# Altium schematic sheet CDRon_mainSheet.SchDoc
size A4
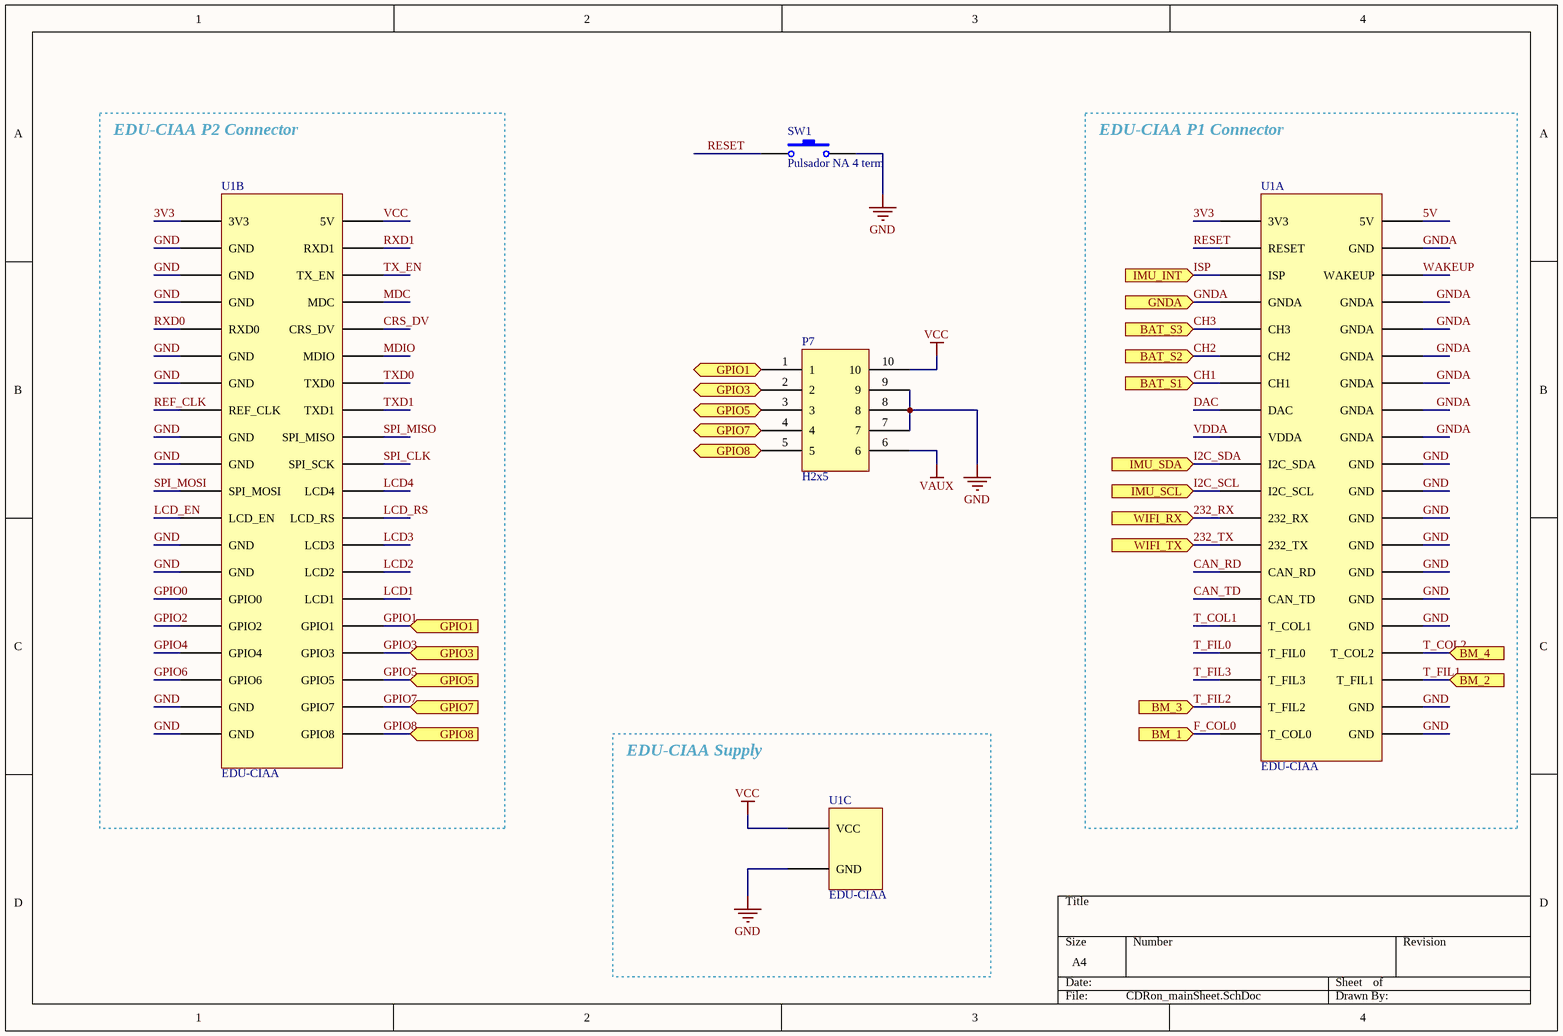
[diagram p0: CDRon_mainSheet.SchDoc]

## Parts
P7  H2x5  [H2x5]
SW1  Pulsador NA 4 term  [TACT SW]
U1  EDU-CIAA  [EDU-CIAA]  (parts A,B,C of 3)

## Blocks framed on the sheet
EDU-CIAA P2 Connector: U1
EDU-CIAA P1 Connector: U1
EDU-CIAA Supply: U1

## Ports
BAT_S1 (in), BAT_S2 (in), BAT_S3 (in), BM_1 (in), BM_2 (in), BM_3 (in), BM_4 (in), GNDA (in), GPIO1 (in), GPIO3 (in), GPIO5 (in), GPIO7 (in), GPIO8 (in), IMU_INT (in), IMU_SCL (in), IMU_SDA (in), WIFI_RX (in), WIFI_TX (in)

## Nets
GND: P7.7 P7.8 P7.9 SW1.2 U1.20(GND) U1.22(GND) U1.24(GND) U1.26(GND) U1.28(GND) U1.30(GND) U1.32(GND) U1.38(GND) U1.40(GND) U1.43(GND) U1.45(GND) U1.47(GND) U1.51(GND) U1.53(GND) U1.57(GND) U1.59(GND) U1.65(GND) U1.67(GND) U1.77(GND) U1.79(GND) U1.82(GND)
VAUX: P7.6
VCC: P7.10 U1.42(5V) U1.81(VCC)
3V3: U1.1(3V3) U1.41(3V3)
5V: U1.2(5V)
232_RX: U1.23(232_RX) ; port WIFI_RX
232_TX: U1.25(232_TX) ; port WIFI_TX
CAN_RD: U1.27(CAN_RD)
CAN_TD: U1.29(CAN_TD)
CH1: U1.13(CH1) ; port BAT_S1
CH2: U1.11(CH2) ; port BAT_S2
CH3: U1.9(CH3) ; port BAT_S3
CRS_DV: U1.50(CRS_DV)
DAC: U1.15(DAC)
F_COL0: U1.39(T_COL0) ; port BM_1
GNDA: U1.4(GND) U1.7(GNDA) U1.8(GNDA) U1.10(GNDA) U1.12(GNDA) U1.14(GNDA) U1.16(GNDA) U1.18(GNDA) ; port GNDA
GPIO0: U1.69(GPIO0)
GPIO1: P7.1 U1.72(GPIO1) ; port GPIO1
GPIO2: U1.71(GPIO2)
GPIO3: P7.2 U1.74(GPIO3) ; port GPIO3
GPIO4: U1.73(GPIO4)
GPIO5: P7.3 U1.76(GPIO5) ; port GPIO5
GPIO6: U1.75(GPIO6)
GPIO7: P7.4 U1.78(GPIO7) ; port GPIO7
GPIO8: P7.5 U1.80(GPIO8) ; port GPIO8
I2C_SCL: U1.21(I2C_SCL) ; port IMU_SCL
I2C_SDA: U1.19(I2C_SDA) ; port IMU_SDA
ISP: U1.5(ISP) ; port IMU_INT
LCD1: U1.70(LCD1)
LCD2: U1.68(LCD2)
LCD3: U1.66(LCD3)
LCD4: U1.62(LCD4)
LCD_EN: U1.63(LCD_EN)
LCD_RS: U1.64(LCD_RS)
MDC: U1.48(MDC)
MDIO: U1.52(MDIO)
REF_CLK: U1.55(REF_CLK)
RESET: SW1.1 U1.3(RESET)
RXD0: U1.49(RXD0)
RXD1: U1.44(RXD1)
SPI_CLK: U1.60(SPI_SCK)
SPI_MISO: U1.58(SPI_MISO)
SPI_MOSI: U1.61(SPI_MOSI)
T_COL1: U1.31(T_COL1)
T_COL2: U1.34(T_COL2) ; port BM_4
T_FIL0: U1.33(T_FIL0)
T_FIL1: U1.36(T_FIL1) ; port BM_2
T_FIL2: U1.37(T_FIL2) ; port BM_3
T_FIL3: U1.35(T_FIL3)
TX_EN: U1.46(TX_EN)
TXD0: U1.54(TXD0)
TXD1: U1.56(TXD1)
VDDA: U1.17(VDDA)
WAKEUP: U1.6(WAKEUP)

## Library data of the parts
SW1 = Pulsador NA 4 term: .Creator: G; .PCBCheck: G; .SCHCheck: G